# Altium schematic sheet iso-a4.SchDoc: Title
size 297 x 209 mm; Author: Author; Organization: Organization; Revision: Revision; PageSize: A4; ProjectName: Project Name
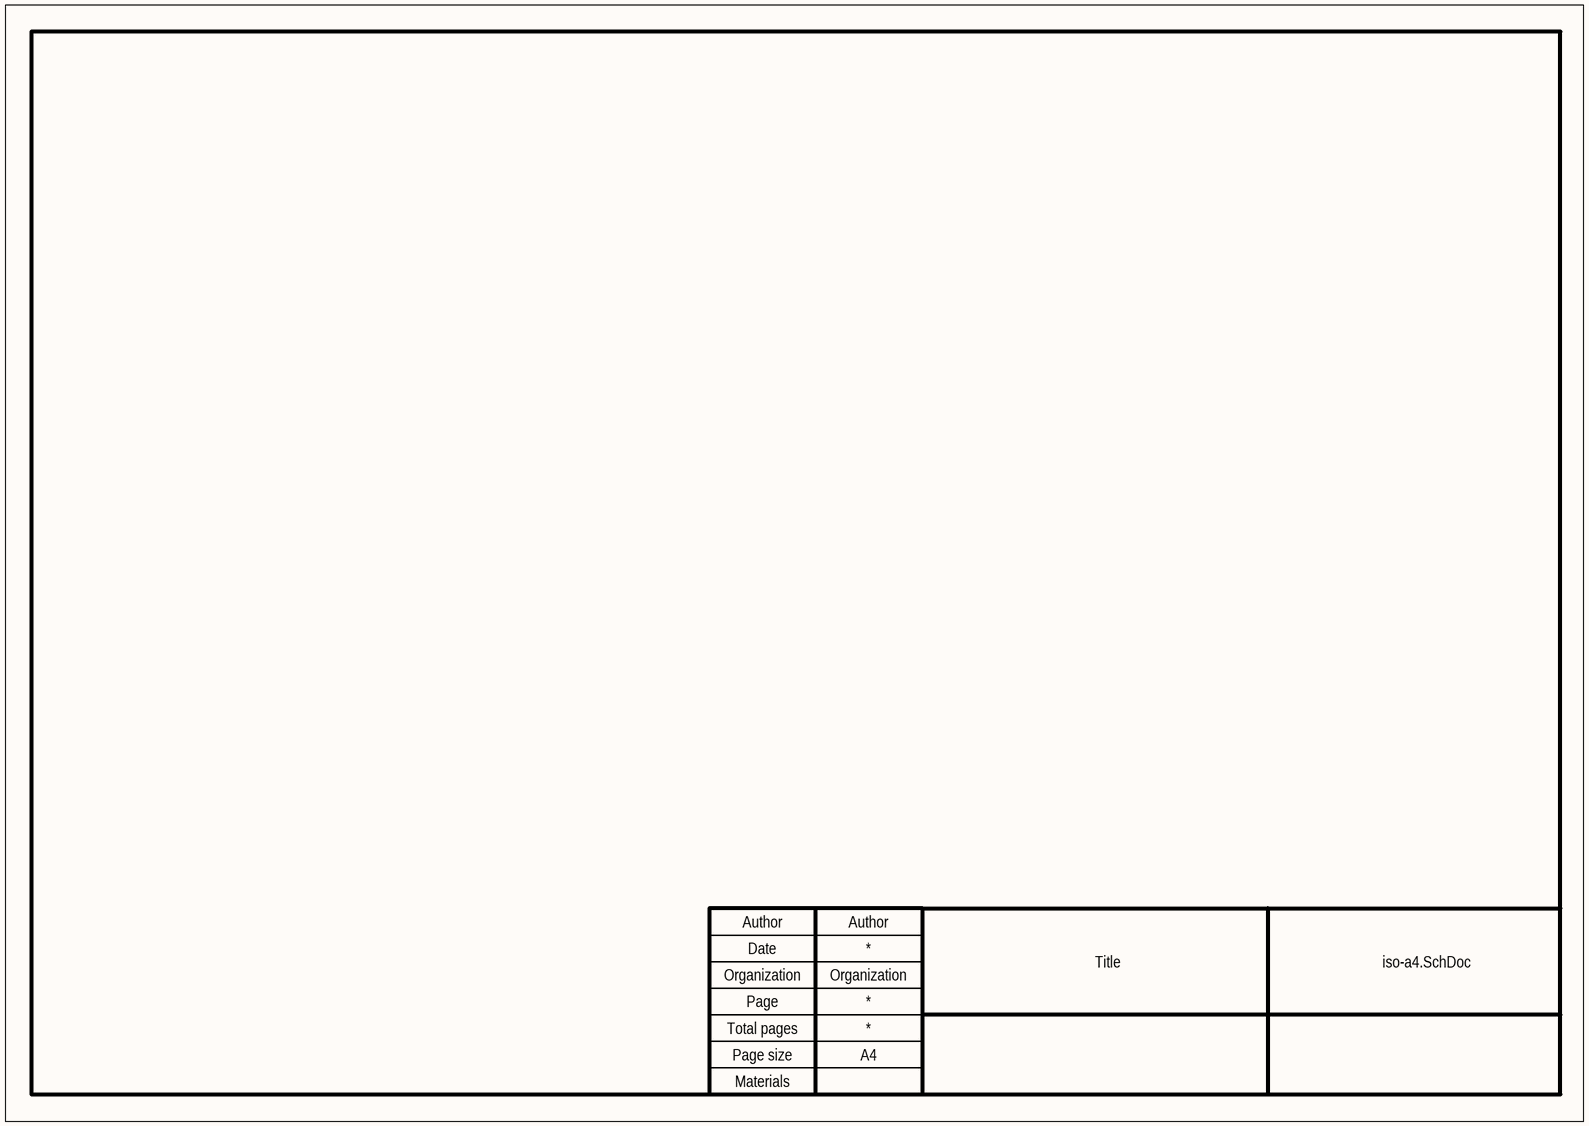
[diagram p0: iso-a4.SchDoc]

## Notes on the sheet
- Author
- Date
- Organization
- Page
- Total pages
- Materials
- Page size